# EAGLE design nucleo-shield (EAGLE 7.4.0)
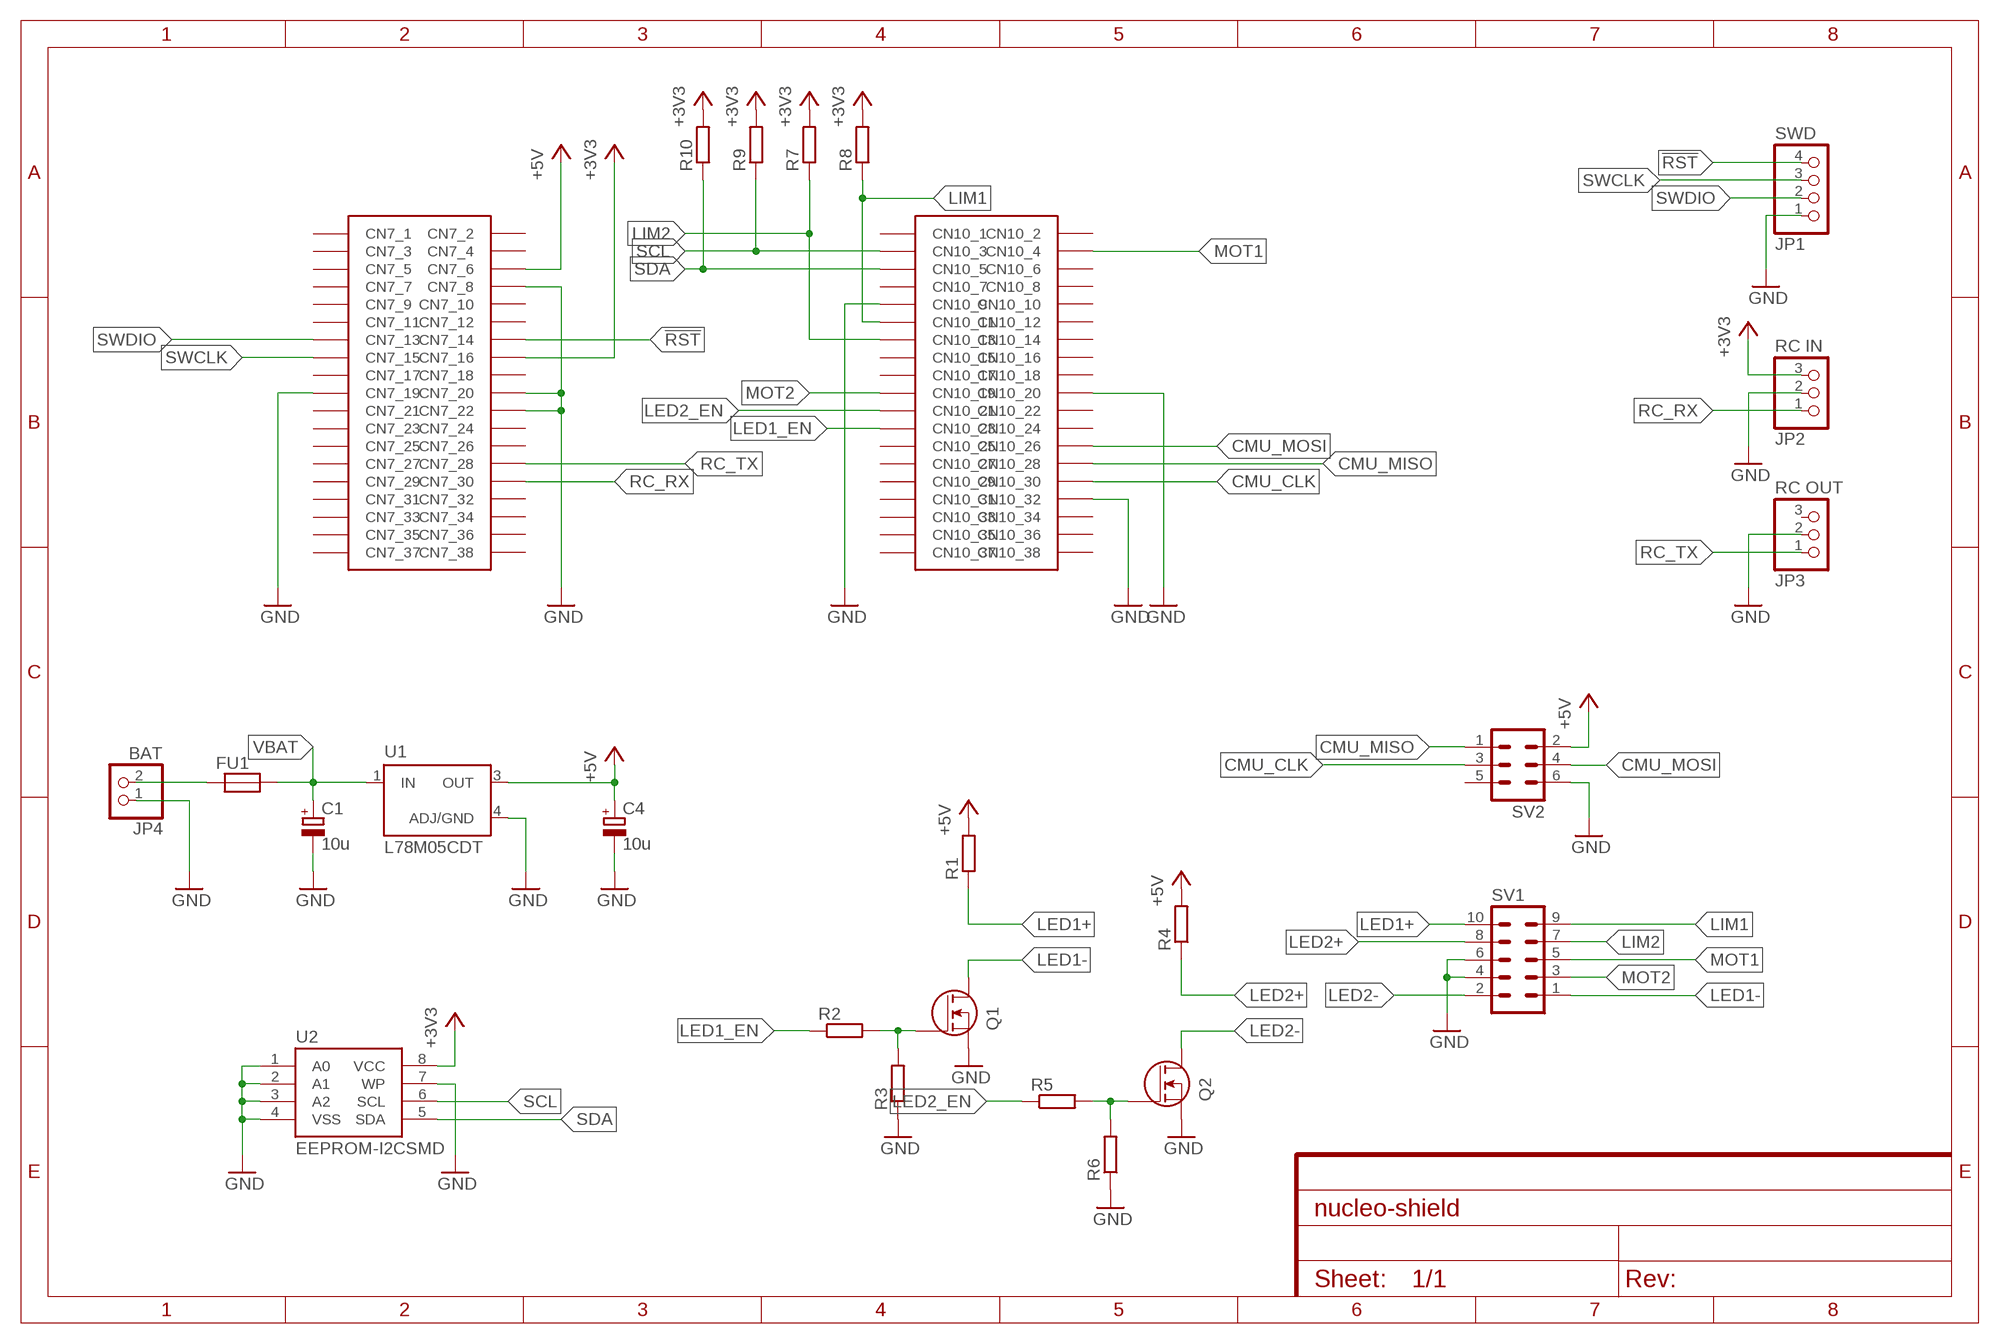
[diagram p0: schematic, sheet 1]

## Parts
C1  10u  CPOL-EUSMCA  [SMC_A]
C4  10u  CPOL-EUSMCA  [SMC_A]
FU1  PTC_FUSE  [C1812K]
JP1  SWD  PINHD-1X4  [1X04]
JP2  RC IN  PINHD-1X3  [1X03]
JP3  RC OUT  PINHD-1X3  [1X03]
JP4  BAT  PINHD-1X2  [1X02]
Q1  MOSFET-N-SOT23-3  [SOT23-3]
Q2  MOSFET-N-SOT23-3  [SOT23-3]
R1  R-EU_R0805  [R0805]
R2  R-EU_R0805  [R0805]
R3  R-EU_R0805  [R0805]
R4  R-EU_R0805  [R0805]
R5  R-EU_R0805  [R0805]
R6  R-EU_R0805  [R0805]
R7  R-EU_R0805  [R0805]
R8  R-EU_R0805  [R0805]
R9  R-EU_R0805  [R0805]
R10  R-EU_R0805  [R0805]
SV1  ML10L  [ML10L]
SV2  ML6L  [ML6L]
U1  L78M05CDT  VREG-3PIN-DPAK  [DPAK]
U2  EEPROM-I2CSMD  [SO08]
U$2  NUCLEO-MORPHO-64  [NUCLEO-64-MORPHO]

## Nets
!RST: JP1.4 U$2.CN7_14
+3V3: JP2.3 R7.2 R8.2 R9.2 R10.2 U2.8(VCC) U$2.CN7_16
+5V: C4.+ R1.2 R4.2 SV2.2 U1.3(OUT) U$2.CN7_6
CMU_CLK: SV2.3 U$2.CN10_30
CMU_MISO: SV2.1 U$2.CN10_28
CMU_MOSI: SV2.4 U$2.CN10_26
GND: C1.- C4.- JP1.1 JP2.2 JP3.2 JP4.1 Q1.2(S) Q2.2(S) R3.1 R6.1 SV1.4 SV1.6 SV2.6 U1.4(ADJ/GND) U2.1(A0) U2.2(A1) U2.3(A2) U2.4(VSS) U2.7(WP) U$2.CN7_8 U$2.CN7_19 U$2.CN7_20 U$2.CN7_22 U$2.CN10_9 U$2.CN10_20 U$2.CN10_32
LED1+: R1.1 SV1.10
LED1-: Q1.3(D) SV1.1
LED1_EN: R2.1 U$2.CN10_23
LED2+: R4.1 SV1.8
LED2-: Q2.3(D) SV1.2
LED2_EN: R5.1 U$2.CN10_21
LIM1: R8.1 SV1.9 U$2.CN10_11
LIM2: R7.1 SV1.7 U$2.CN10_13
MOT1: SV1.5 U$2.CN10_4
MOT2: SV1.3 U$2.CN10_19
N$1: Q1.1(G) R2.2 R3.2
N$3: FU1.1 JP4.2
N$4: Q2.1(G) R5.2 R6.2
RC_RX: JP2.1 U$2.CN7_30
RC_TX: JP3.1 U$2.CN7_28
SCL: R9.1 U2.6(SCL) U$2.CN10_3
SDA: R10.1 U2.5(SDA) U$2.CN10_5
SWCLK: JP1.3 U$2.CN7_15
SWDIO: JP1.2 U$2.CN7_13
VBAT: C1.+ FU1.2 U1.1(IN)
Unconnected: JP3.3 SV2.5 U$2.CN7_1 U$2.CN7_2 U$2.CN7_3 U$2.CN7_4 U$2.CN7_5 U$2.CN7_7 U$2.CN7_9 U$2.CN7_10 U$2.CN7_11 U$2.CN7_12 U$2.CN7_17 U$2.CN7_18 U$2.CN7_21 U$2.CN7_23 U$2.CN7_24 U$2.CN7_25 U$2.CN7_26 U$2.CN7_27 U$2.CN7_29 U$2.CN7_31 U$2.CN7_32 U$2.CN7_33 U$2.CN7_34 U$2.CN7_35 U$2.CN7_36 U$2.CN7_37 U$2.CN7_38 U$2.CN10_1 U$2.CN10_2 U$2.CN10_6 U$2.CN10_7 U$2.CN10_8 U$2.CN10_10 U$2.CN10_12 U$2.CN10_14 U$2.CN10_15 U$2.CN10_16 U$2.CN10_17 U$2.CN10_18 U$2.CN10_22 U$2.CN10_24 U$2.CN10_25 U$2.CN10_27 U$2.CN10_29 U$2.CN10_31 U$2.CN10_33 U$2.CN10_34 U$2.CN10_35 U$2.CN10_36 U$2.CN10_37 U$2.CN10_38

## Library data of the parts
C1 C4 = rcl:CPOL-EU: POLARIZED CAPACITOR, European symbol
FU1 = kg-generic:PTC_FUSE
JP1 = pinhead:PINHD-1X4: PIN HEADER
JP2 JP3 = pinhead:PINHD-1X3: PIN HEADER
JP4 = pinhead:PINHD-1X2: PIN HEADER
Q1 Q2 = kg-generic:MOSFET-N: Generic N-MOSFET MFG P/N Package Description IRF7406 SO8 30V/5.8A SI7820DN TRANS-11055 FDS6630A IC-08089 2N7002PW TRANS-11151 FQP30N06L COM-10213 TRANS-10060 BSS123LT1G TRANS-08345 BSS138 TRANS-00830 BS170 2N7000
R1-R10 = rcl:R-EU_: RESISTOR, European symbol
SV1 = con-ml:ML10L: HARTING; OC_FARNELL: unknown; OC_NEWARK: unknown
SV2 = con-ml:ML6L: HARTING; OC_FARNELL: unknown; OC_NEWARK: unknown
U1 = kg-generic:VREG-3PIN: Generic 3-pin linear voltage regulator
U2 = SparkFun-DigitalIC:EEPROM-I2C: I2C EEPROM chips, 24LC256 (and others)
U$2 = kg-modules:NUCLEO-MORPHO-64

## Board
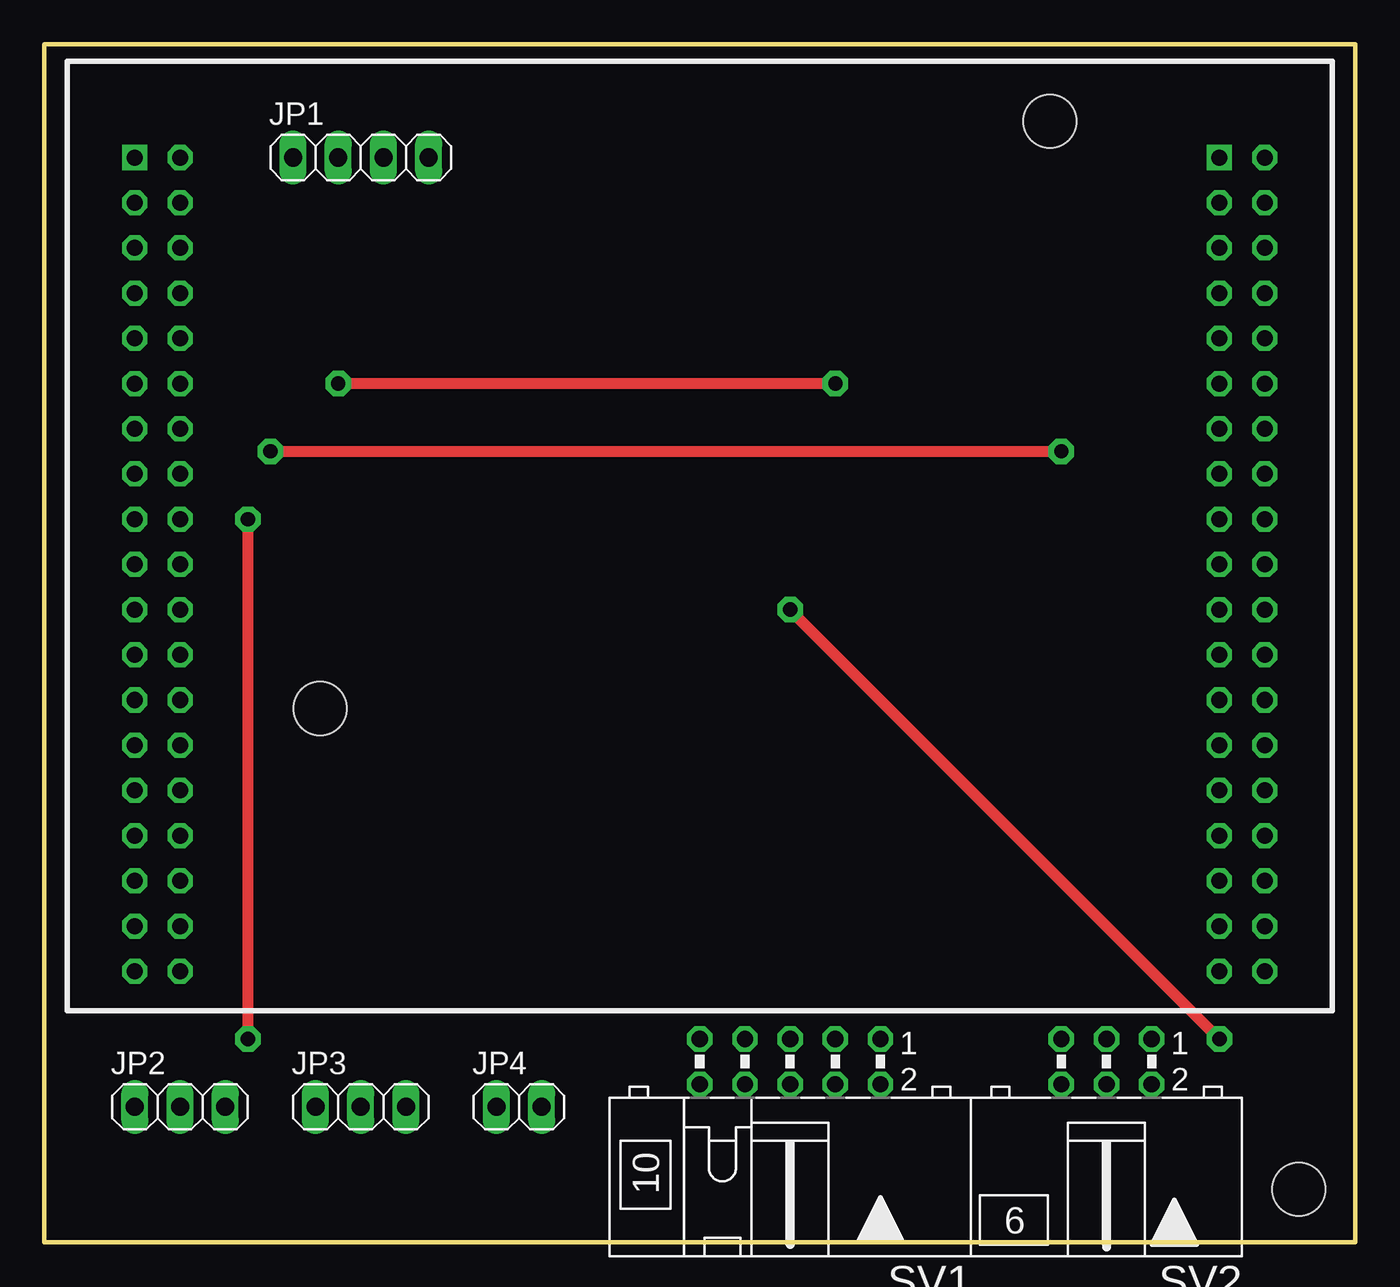
[diagram p1: board, top side]
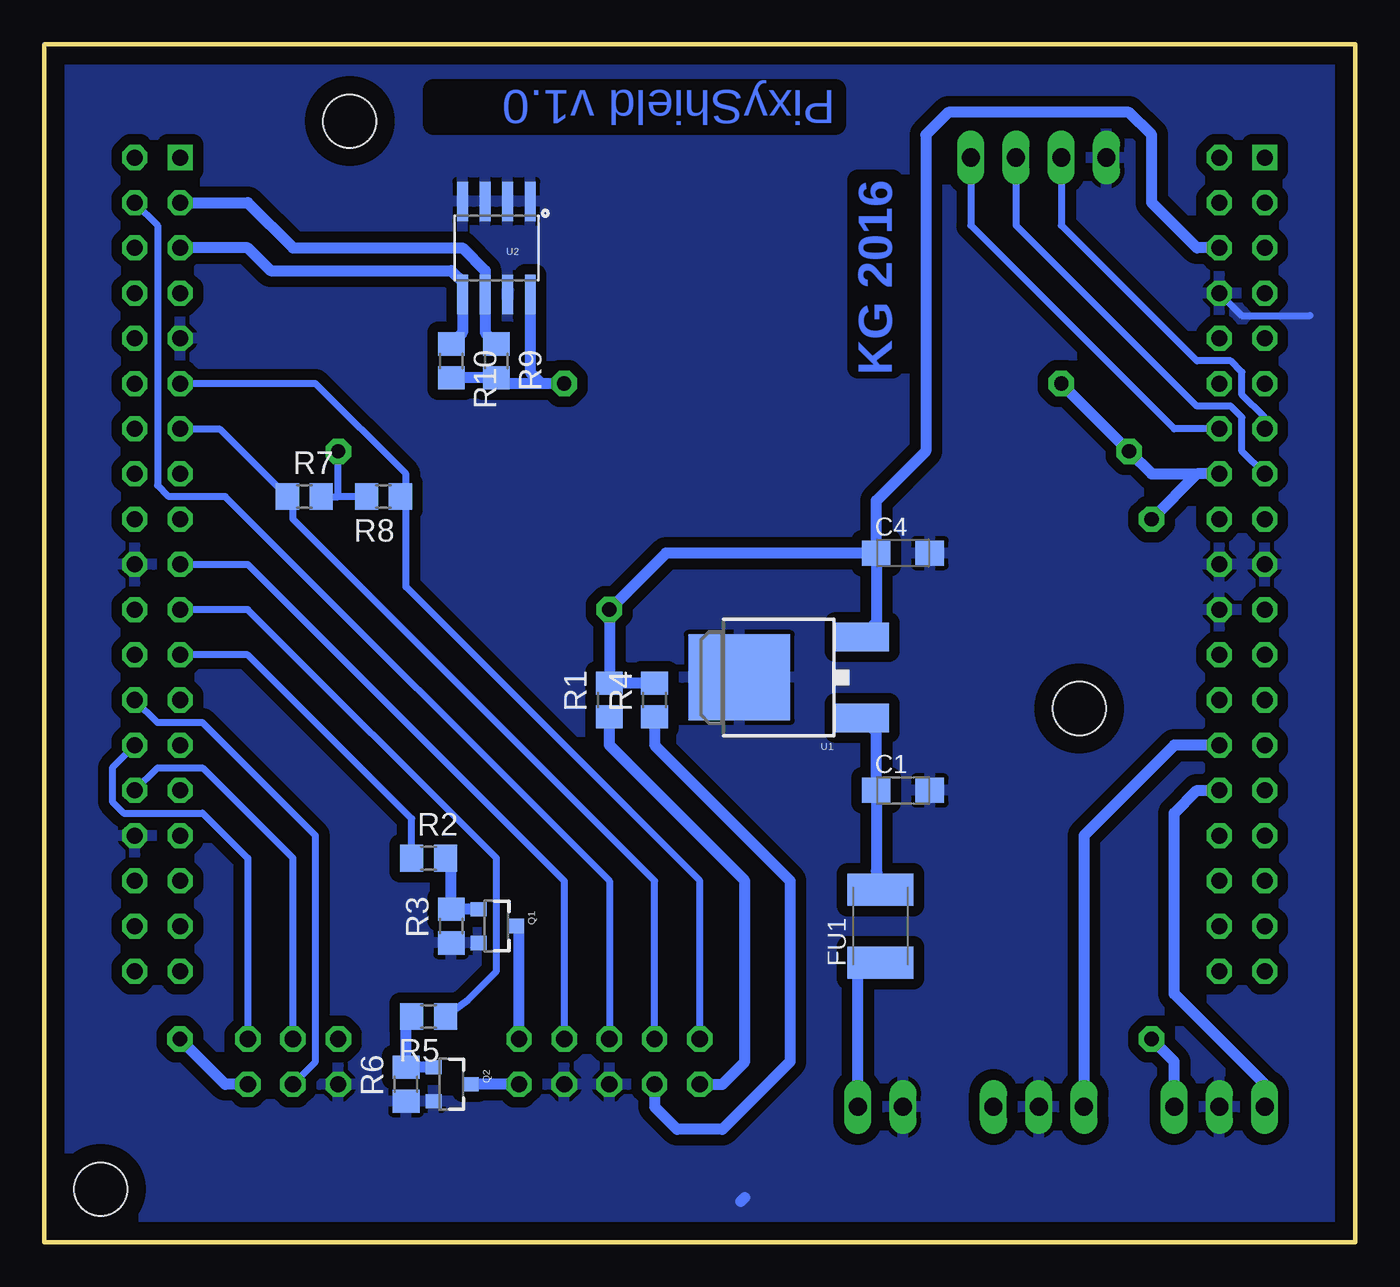
[diagram p2: board, bottom side, seen from below]

Size 73.66 x 67.31 mm. Coordinates in mm from the lower left corner, seen from the top.
Outline: 0,67.31 0,0 73.66,0 73.66,67.31 0,67.31
Copper layers (1*16): Top 0.035mm / dielectric 1.5mm / Bottom 0.035mm
Design rules "default": minimum track width 10mil, minimum drill 24mil, track to track 8mil, track to pad 8mil, pad to pad 8mil, via to via 8mil, smd to smd 8mil, copper to edge 40mil, drill to drill 8mil, minimum pad ring 10mil, minimum via ring 8mil, stop-mask expansion 4mil, vias tented up to drill 0mil, thermal gap 10mil
Holes 3 mm at 70.5,3 15.5,30 56.5,63

### Footprints (pad centres in the part's own frame; a part is rotated, then mirrored left to right if it is on the bottom)
SMC_A = smd 1.6 x 1.4: + -1.5,0; - 1.5,0
C1812K = smd 1.8 x 3.7: 1 -2.05,0; 2 2.05,0
1X04 = drill 1.016 long: 1 -3.81,0; 2 -1.27,0; 3 1.27,0; 4 3.81,0
1X03 = drill 1.016 long: 1 -2.54,0; 2 0,0; 3 2.54,0
1X02 = drill 1.016 long: 1 -1.27,0; 2 1.27,0
SOT23-3 = smd 0.8 x 0.9: 1 -0.95,-1; 2 0.95,-1; 3 0,1.1
R0805 = smd 1.3 x 1.5: 1 -0.95,0; 2 0.95,0
ML10L = drill 0.914 octagon: 1 -5.08,-1.27; 2 -5.08,1.27; 3 -2.54,-1.27; 4 -2.54,1.27; 5 0,-1.27; 6 0,1.27; 7 2.54,-1.27; 8 2.54,1.27; 9 5.08,-1.27; 10 5.08,1.27
ML6L = drill 0.914 octagon: 1 -2.54,-1.27; 2 -2.54,1.27; 3 0,-1.27; 4 0,1.27; 5 2.54,-1.27; 6 2.54,1.27
DPAK = smd 1.6 x 3: 1 -2.28,-5.31; 3 2.28,-5.31 | smd 4.826 x 5.715: 4 0,1.588
SO08 = smd 0.61 x 2.21: 1 -1.905,-2.616; 2 -0.635,-2.616; 3 0.635,-2.616; 4 1.905,-2.616; 5 1.905,2.616; 6 0.635,2.616; 7 -0.635,2.616; 8 -1.905,2.616
NUCLEO-64-MORPHO = drill 0.9 square: CN7_1 0,45.72; CN10_1 60.96,45.72 | drill 0.9 octagon: CN7_2 2.54,45.72; CN7_3 0,43.18; CN7_4 2.54,43.18; CN7_5 0,40.64; CN7_6 2.54,40.64; CN7_7 0,38.1; CN7_8 2.54,38.1; CN7_9 0,35.56; CN7_10 2.54,35.56; CN7_11 0,33.02; CN7_12 2.54,33.02; CN7_13 0,30.48; CN7_14 2.54,30.48; CN7_15 0,27.94; CN7_16 2.54,27.94; CN7_17 0,25.4; CN7_18 2.54,25.4; CN7_19 0,22.86; CN7_20 2.54,22.86; CN7_21 0,20.32; CN7_22 2.54,20.32; CN7_23 0,17.78; CN7_24 2.54,17.78; CN7_25 0,15.24; CN7_26 2.54,15.24; CN7_27 0,12.7; CN7_28 2.54,12.7; CN7_29 0,10.16; CN7_30 2.54,10.16; CN7_31 0,7.62; CN7_32 2.54,7.62; CN7_33 0,5.08; CN7_34 2.54,5.08; CN7_35 0,2.54; CN7_36 2.54,2.54; CN7_37 0,0; CN7_38 2.54,0; CN10_2 63.5,45.72; CN10_3 60.96,43.18; CN10_4 63.5,43.18; CN10_5 60.96,40.64; CN10_6 63.5,40.64; CN10_7 60.96,38.1; CN10_8 63.5,38.1; CN10_9 60.96,35.56; CN10_10 63.5,35.56; CN10_11 60.96,33.02; CN10_12 63.5,33.02; CN10_13 60.96,30.48; CN10_14 63.5,30.48; CN10_15 60.96,27.94; CN10_16 63.5,27.94; CN10_17 60.96,25.4; CN10_18 63.5,25.4; CN10_19 60.96,22.86; CN10_20 63.5,22.86; CN10_21 60.96,20.32; CN10_22 63.5,20.32; CN10_23 60.96,17.78; CN10_24 63.5,17.78; CN10_25 60.96,15.24; CN10_26 63.5,15.24; CN10_27 60.96,12.7; CN10_28 63.5,12.7; CN10_29 60.96,10.16; CN10_30 63.5,10.16; CN10_31 60.96,7.62; CN10_32 63.5,7.62; CN10_33 60.96,5.08; CN10_34 63.5,5.08; CN10_35 60.96,2.54; CN10_36 63.5,2.54; CN10_37 60.96,0; CN10_38 63.5,0

### Placement (x,y rotation side)
C1  25.4,25.4 0 bottom
C4  25.4,38.73 0 bottom
FU1  26.67,17.78 90 bottom
JP1  17.78,60.96 0 top
JP2  7.62,7.62 0 top
JP3  17.78,7.62 0 top
JP4  26.67,7.62 0 top
Q1  48.26,17.78 270 bottom
Q2  50.8,8.89 270 bottom
R1  41.91,30.48 90 bottom
R2  52.07,21.59 0 bottom
R3  50.8,17.78 90 bottom
R4  39.37,30.48 90 bottom
R5  52.07,12.7 180 bottom
R6  53.34,8.89 90 bottom
R7  59.05,41.91 0 bottom
R8  54.61,41.91 180 bottom
R9  48.26,49.53 270 bottom
R10  50.8,49.53 270 bottom
SV1  41.91,10.16 180 top
SV2  59.69,10.16 180 top
U1  33.02,31.75 90 bottom
U2  48.26,55.88 180 bottom
U$2  5.08,15.24 0 top

### Tracks (layer width: path | path; a pad name or v marks a point on that pad's centre or on a via)
!RST
  Bottom 0.406: U$2.CN7_14 10.16,45.72 21.59,57.15 JP1.4
+3V3  (via drill 0.8 pad 1.42)
  Top 0.61: v11.43,40.64 v11.43,11.43 | v12.7,44.45 v57.15,44.45 | v44.45,48.26 v16.51,48.26
  Bottom 0.406: R8.2 57.15,41.91 | 57.15,41.91 v57.15,44.45 | R7.2 57.15,41.91
  Bottom 0.61: U$2.CN7_16 8.89,43.18 | 8.89,43.18 v11.43,40.64 | JP2.3 10.16,10.16 v11.43,11.43 | 8.89,43.18 11.43,43.18 v12.7,44.45 v16.51,48.26 | U2.8 46.35,48.9 45.72,48.26 | 45.72,48.26 47.94,48.26 R9.2 R10.2 | v44.45,48.26 45.72,48.26
+5V  (via drill 0.8 pad 1.42)
  Top 0.61: v66.04,11.43 v41.91,35.56
  Bottom 0.61: U$2.CN7_6 8.89,55.88 11.43,58.42 11.43,62.23 12.7,63.5 22.86,63.5 24.13,62.23 24.13,44.45 26.9,41.68 C4.+ | C4.+ 38.73,38.73 v41.91,35.56 R1.2 R4.2 | C4.+ 26.9,34.84 U1.3 | SV2.2 63.5,8.89 v66.04,11.43
CMU_CLK
  Bottom 0.406: SV2.3 59.69,21.59 64.77,26.67 67.31,26.67 U$2.CN10_30
CMU_MISO
  Bottom 0.406: U$2.CN10_28 69.85,26.67 69.85,24.77 69.22,24.13 64.77,24.13 62.23,21.59 SV2.1
CMU_MOSI
  Bottom 0.406: SV2.4 58.42,10.16 58.42,22.86 64.77,29.21 67.31,29.21 U$2.CN10_26
GND
  Bottom 0.406: U$2.CN7_8 6.35,52.07 2.54,52.07
  Bottom 0.61: 34.53,2.29 34.29,2.54
  pour Bottom (isolate 0.61): 0,71.12 5.08,76.2 68.58,76.2 73.66,71.12 73.66,6.35 68.58,1.27 0,1.27
LED1+
  Bottom 0.61: SV1.10 35.56,8.89 34.29,10.16 34.29,20.32 41.91,27.94 R1.1
LED1-
  Bottom 0.61: SV1.1 46.99,17.61 Q1.3
LED1_EN
  Bottom 0.406: U$2.CN10_23 62.23,33.02 53.02,23.81 R2.1
LED2+
  Bottom 0.61: SV1.8 39.37,7.62 38.1,6.35 35.56,6.35 31.75,10.16 31.75,20.32 39.37,27.94 R4.1
LED2-
  Bottom 0.61: SV1.2 Q2.3
LED2_EN
  Bottom 0.406: R5.1 49.85,13.65 48.26,15.24 48.26,21.59 62.23,35.56 U$2.CN10_21
LIM1
  Bottom 0.406: SV1.9 36.83,20.32 53.34,36.83 53.34,41.91 | 53.34,41.91 53.34,43.18 58.42,48.26 U$2.CN10_11 | R8.1 53.34,41.91
LIM2
  Bottom 0.406: SV1.7 39.37,20.32 59.69,40.64 59.69,41.59 R7.1 63.81,45.72 U$2.CN10_13
MOT1
  Bottom 0.406: SV1.5 41.91,20.32 63.5,41.91 66.67,41.91 67.31,42.55 67.31,57.15 U$2.CN10_4
MOT2
  Bottom 0.406: U$2.CN10_19 62.23,38.1 44.45,20.32 SV1.3
N$1
  Bottom 0.61: Q1.1 R3.2 50.8,21.27 R2.2
N$3
  Bottom 0.61: JP4.2 27.94,15.24 27.45,15.73 FU1.1
N$4
  Bottom 0.61: Q2.1 R6.2 53.34,12.38 R5.2
RC_RX
  Bottom 0.61: JP2.1 5.08,8.89 10.16,13.97 10.16,24.13 8.89,25.4 U$2.CN7_30
RC_TX
  Bottom 0.61: U$2.CN7_28 10.16,27.94 15.24,22.86 JP3.1
SCL
  Bottom 0.61: U$2.CN10_3 62.23,58.42 59.69,55.88 50.16,55.88 48.9,54.61 U2.6 48.9,51.12 R9.1
SDA
  Bottom 0.61: U$2.CN10_5 62.23,55.88 60.96,54.61 50.8,54.61 50.16,53.98 U2.5 50.16,51.12 R10.1
SWCLK
  Bottom 0.406: U$2.CN7_15 6.35,44.45 6.35,46.35 6.99,46.99 8.89,46.99 19.05,57.15 JP1.3
SWDIO
  Bottom 0.406: U$2.CN7_13 5.08,46.35 6.35,47.62 6.35,48.9 6.99,49.53 8.89,49.53 16.51,57.15 JP1.2
VBAT
  Bottom 0.61: U1.1 26.9,28.66 C1.+ 26.9,20.87 FU1.2

### Text on the board
Bottom: PixyShield v1.0 | KG 2016